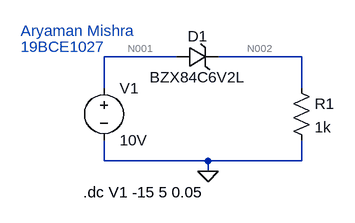
[diagram p0: schematic 4 zener diode characteristics.asc]
4 zener diode characteristics.asc, the LTspice schematic file:
Version 4
SHEET 1 880 680
WIRE 208 80 96 80
WIRE 400 80 272 80
WIRE 96 128 96 80
WIRE 400 128 400 80
WIRE 96 240 96 208
WIRE 256 240 96 240
WIRE 400 240 400 208
WIRE 400 240 256 240
WIRE 256 256 256 240
FLAG 256 256 0
SYMBOL voltage 96 112 R0
WINDOW 123 0 0 Left 0
WINDOW 39 0 0 Left 0
SYMATTR InstName V1
SYMATTR Value 10V
SYMBOL zener 208 96 R270
WINDOW 0 32 32 VTop 2
WINDOW 3 0 32 VBottom 2
SYMATTR InstName D1
SYMATTR Value BZX84C6V2L
SYMATTR Description Diode
SYMATTR Type diode
SYMBOL res 384 112 R0
SYMATTR InstName R1
SYMATTR Value 1k
TEXT 64 288 Left 2 !.dc V1 -15 5 0.05
TEXT -32 40 Left 2 ;Aryaman Mishra
TEXT -32 64 Left 2 ;19BCE1027

The netlist it stands for:
* 4 zener diode characteristics.asc
V1 N001 0 10V
D1 N001 N002 BZX84C6V2L
R1 N002 0 1k
.model D D
.lib standard.dio
.dc V1 -15 5 0.05
* Aryaman Mishra
* 19BCE1027
.backanno
.end

* Results of the author's LTspice run, read from the files saved beside the schematic
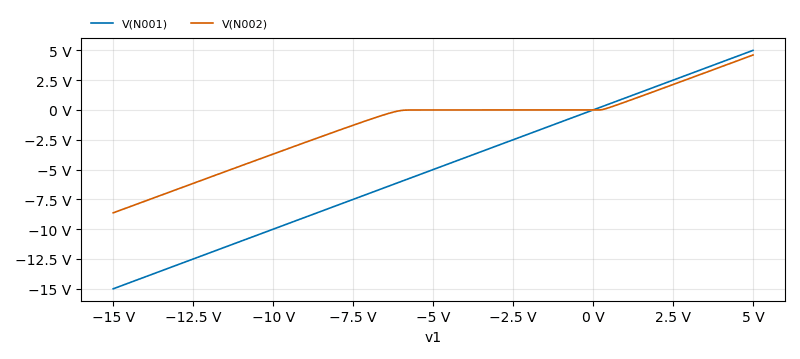
[diagram p1: DC transfer characteristic of 4 zener diode characteristics.asc, plotted from the saved traces]
* DC transfer characteristic, 1 run:
*   V(N001): -15 V at v1=-15 V, 5 V at v1=5 V, min -15 V, max 5 V
*   V(N002): -8.628 V at v1=-15 V, 4.611 V at v1=5 V, min -8.628 V, max 4.611 V